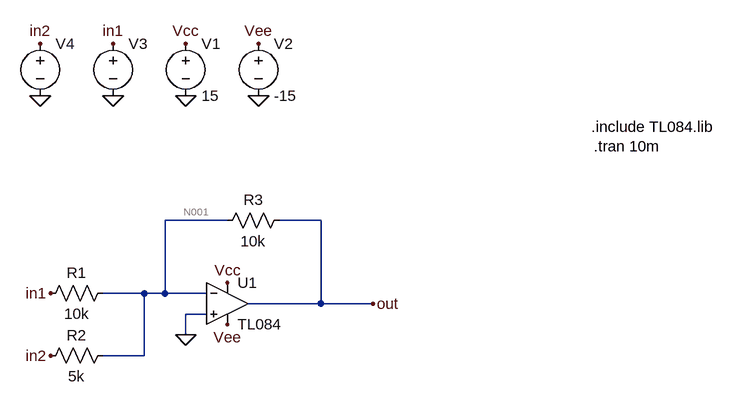
[diagram p0: schematic adder.asc]
adder.asc, the LTspice schematic file:
Version 4
SHEET 1 1280 680
WIRE 512 -96 416 -96
WIRE 656 -96 592 -96
WIRE 384 16 320 16
WIRE 416 16 416 -96
WIRE 416 16 384 16
WIRE 480 16 416 16
WIRE 656 32 656 -96
WIRE 656 32 544 32
WIRE 736 32 656 32
WIRE 480 48 448 48
WIRE 448 80 448 48
WIRE 384 112 384 16
WIRE 384 112 320 112
FLAG 448 80 0
FLAG 512 0 Vcc
FLAG 512 64 Vee
FLAG 240 16 in1
FLAG 240 112 in2
FLAG 736 32 out
FLAG 448 -288 0
FLAG 560 -288 0
FLAG 448 -368 Vcc
FLAG 560 -368 Vee
FLAG 336 -288 0
FLAG 336 -368 in1
FLAG 224 -288 0
FLAG 224 -368 in2
SYMBOL Opamps\\opamp2 512 -32 R0
SYMATTR InstName U1
SYMATTR Value TL084
SYMBOL res 336 0 R90
WINDOW 0 0 56 VBottom 2
WINDOW 3 32 56 VTop 2
SYMATTR InstName R1
SYMATTR Value 10k
SYMBOL res 336 96 R90
WINDOW 0 0 56 VBottom 2
WINDOW 3 32 56 VTop 2
SYMATTR InstName R2
SYMATTR Value 5k
SYMBOL res 608 -112 R90
WINDOW 0 0 56 VBottom 2
WINDOW 3 32 56 VTop 2
SYMATTR InstName R3
SYMATTR Value 10k
SYMBOL voltage 448 -384 R0
WINDOW 123 0 0 Left 0
WINDOW 39 0 0 Left 0
SYMATTR InstName V1
SYMATTR Value 15
SYMBOL voltage 560 -384 R0
WINDOW 123 0 0 Left 0
WINDOW 39 0 0 Left 0
SYMATTR InstName V2
SYMATTR Value -15
SYMBOL voltage 336 -384 R0
WINDOW 3 24 96 Invisible 2
WINDOW 123 0 0 Left 0
WINDOW 39 0 0 Left 0
SYMATTR Value SINE(0 1 1k)
SYMATTR InstName V3
SYMBOL voltage 224 -384 R0
WINDOW 3 24 96 Invisible 2
WINDOW 123 0 0 Left 0
WINDOW 39 0 0 Left 0
SYMATTR Value 1
SYMATTR InstName V4
TEXT 1076 -210 Left 2 !.tran 10m
TEXT 1072 -240 Left 2 !.include TL084.lib

The netlist it stands for:
* adder.asc
XU1 0 N001 Vcc Vee out TL084  ; pins In+ In- V+ V- OUT
R1 N001 in1 10k
R2 N001 in2 5k
R3 out N001 10k
V1 Vcc 0 15
V2 Vee 0 -15
V3 in1 0 SINE(0 1 1k)
V4 in2 0 1
.tran 10m
.include TL084.lib
.backanno
.end

* Results of the author's LTspice run, read from the files saved beside the schematic
* Operating Point, zero values left out:
*   V(out) = -2 V
*   V(vee) = -15 V
*   V(vcc) = 15 V
*   V(n001) = 19.95 µV
*   V(in2) = 1 V
*   I(R3) = -200 µA
*   I(R2) = -200 µA
*   I(R1) = 1.995 nA
*   I(V4) = -200 µA
*   I(V3) = 1.995 nA
*   I(V2) = 14.19 mA
*   I(V1) = -14.19 mA
*   Ix(u1:IN+) = 45.05 pA
*   Ix(u1:IN-) = 45.05 pA
*   Ix(u1:V+) = 14.19 mA
*   Ix(u1:V-) = -14.19 mA
*   Ix(u1:OUT) = 200 µA
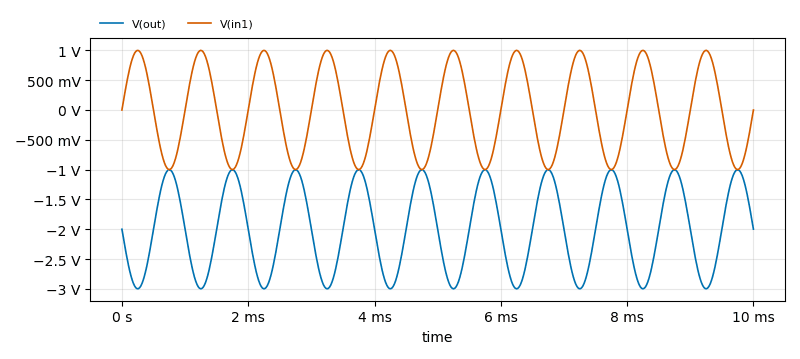
[diagram p1: Transient Analysis of adder.asc, plotted from the saved traces]
* Transient Analysis, 1 run:
*   V(out): min -2.999 V, max -1.001 V, average -2 V, rms 2.121 V, last -1.999 V
*   V(in1): min -1 V, max 1 V, average 0 V, rms 707.1 mV, last 0 V